# Altium schematic sheet Ethernet.SchDoc
size A3; SheetNumber: 2; SheetTotal: 14
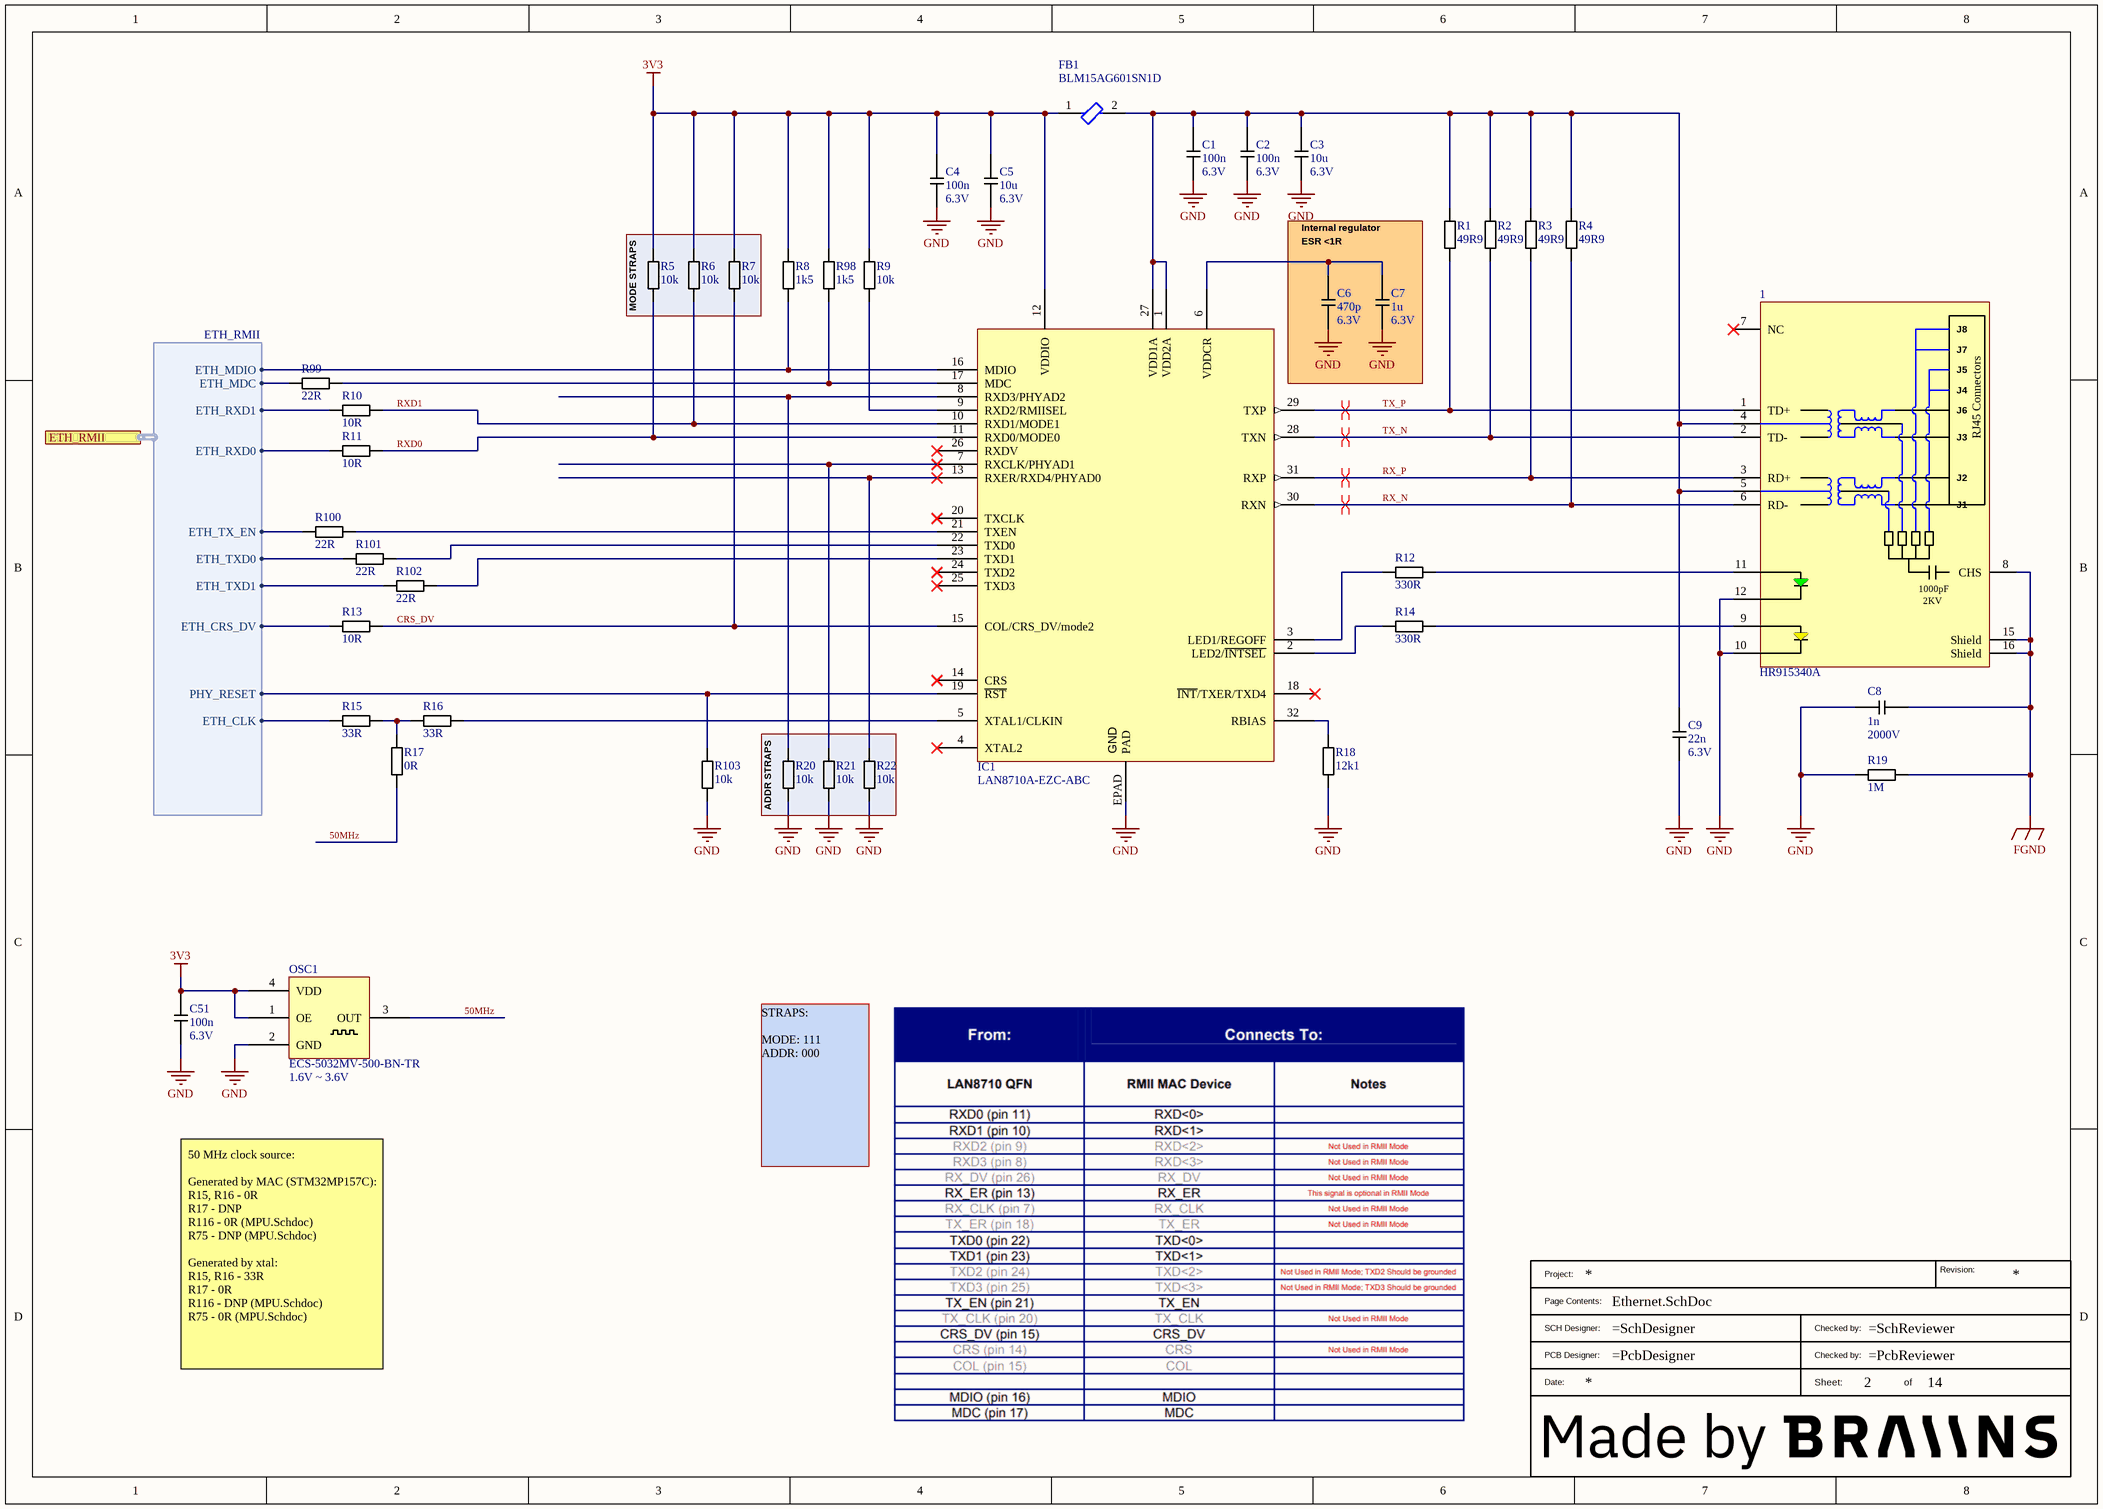
[diagram p0: Ethernet.SchDoc]

## Parts
1  HR915340A  [HR915340A]
?  BraiinsTitleBlockWithLogo  (value not drawn)  (graphical)
C1  Voltage_Rating: 6.3V  [CAP0402]  (hidden comment: 100n)
C2  Voltage_Rating: 6.3V  [CAP0402]  (hidden comment: 100n)
C3  Voltage_Rating: 6.3V  [CAP0805]  (hidden comment: 10u)
C4  Voltage_Rating: 6.3V  [CAP0402]  (hidden comment: 100n)
C5  Voltage_Rating: 6.3V  [CAP0805]  (hidden comment: 10u)
C6  Voltage_Rating: 6.3V  [CAP0402]  (hidden comment: 470p)
C7  Voltage_Rating: 6.3V  [CAP0402]  (hidden comment: 1u)
C8  Voltage_Rating: 2000V  [CAP1206]  (hidden comment: 1n)
C9  Voltage_Rating: 6.3V  [CAP0402]  (hidden comment: 22n)
C51  Voltage_Rating: 6.3V  [CAP0402]  (hidden comment: 100n)
FB1  BLM15AG601SN1D  [FP-BLM15-0_05-MFG]
IC1  LAN8710A-EZC-ABC  [QFN32]
OSC1  Voltage_Rating: 1.6V ~ 3.6V  [5032_CLOCK_GEN]  (hidden comment: ECS-5032MV-500-BN-TR)
R1  49R9  [RES0402]
R2  49R9  [RES0402]
R3  49R9  [RES0402]
R4  49R9  [RES0402]
R5  10k  [RES0402]
R6  10k  [RES0402]
R7  10k  [RES0402]
R8  1k5  [RES0402]
R9  10k  [RES0402]
R10  10R  [RES0402]
R11  10R  [RES0402]
R12  330R  [RES0402]
R13  10R  [RES0402]
R14  330R  [RES0402]
R15  33R  [RES0402]
R16  33R  [RES0402]
R17  0R  [RES0402]
R18  12k1  [RES0402]
R19  1M  [RES0603]
R20  10k  [RES0402]
R21  10k  [RES0402]
R22  10k  [RES0402]
R98  1k5  [RES0402]
R99  22R  [RES0402]
R100  22R  [RES0402]
R101  22R  [RES0402]
R102  22R  [RES0402]
R103  10k  [RES0402]

## Blocks framed on the sheet
MODE STRAPS: R5-R7
ADDR STRAPS: R20-R22

## Ports
ETH_RMII (harness ETH_RMII)

## Harnesses
ETH_RMII: ETH_CRS_DV, ETH_MDC, ETH_MDIO, ETH_CLK, ETH_RXD0, ETH_RXD1, ETH_TXD0, ETH_TXD1, ETH_TX_EN, PHY_RESET

## Nets
3V3: C4.1 C5.1 C51.1 FB1.1 IC1.12(VDDIO) OSC1.1(OE) OSC1.4(VDD) R5.1 R6.1 R7.1 R8.1 R9.1 R98.1
FGND: 1.8(CHS) 1.15(Shield) 1.16(Shield) C8.2 R19.2
GND: 1.10(C) 1.12(C) C1.2 C2.2 C3.2 C4.2 C5.2 C6.2 C7.2 C8.1 C9.2 C51.2 IC1.EPAD(PAD) OSC1.2(GND) R18.2 R19.1 R20.2 R21.2 R22.2 R103.2
50MHz: OSC1.3(OUT) R17.2
CRS_DV: IC1.15(COL/CRS_DV/mode2) R7.2 R13.2
RX_N: 1.6(RD-) IC1.30(RXN) R4.2
RX_P: 1.3(RD+) IC1.31(RXP) R3.2
RXD0: IC1.11(RXD0/MODE0) R5.2 R11.2
RXD1: IC1.10(RXD1/MODE1) R6.2 R10.2
TX_N: 1.2(TD-) IC1.28(TXN) R2.2
TX_P: 1.1(TD+) IC1.29(TXP) R1.2
Net1_4: 1.4 1.5 C1.1 C2.1 C3.1 C9.1 FB1.2 IC1.1(VDD2A) IC1.27(VDD1A) R1.1 R2.1 R3.1 R4.1
Net1_9: 1.9(A) R14.2
Net1_11: 1.11(A) R12.2
NetC6_1: C6.1 C7.1 IC1.6(VDDCR)
NetIC1_2: IC1.2(LED2/~{INTSEL}) R14.1
NetIC1_3: IC1.3(LED1/REGOFF) R12.1
NetIC1_5: IC1.5(XTAL1/CLKIN) R16.2
NetIC1_7: IC1.7(RXCLK/PHYAD1) R21.1
NetIC1_8: IC1.8(RXD3/PHYAD2) R20.1
NetIC1_9: IC1.9(RXD2/RMIISEL) R9.2
NetIC1_13: IC1.13(RXER/RXD4/PHYAD0) R22.1
NetIC1_16: IC1.16(MDIO) R8.2 ; port ETH_RMII.ETH_MDIO
NetIC1_17: IC1.17(MDC) R98.2 R99.2
NetIC1_19: IC1.19(~{RST}) R103.1 ; port ETH_RMII.PHY_RESET
NetIC1_21: IC1.21(TXEN) R100.2
NetIC1_22: IC1.22(TXD0) R101.2
NetIC1_23: IC1.23(TXD1) R102.2
NetIC1_32: IC1.32(RBIAS) R18.1
NetR10_1: R10.1 ; port ETH_RMII.ETH_RXD1
NetR11_1: R11.1 ; port ETH_RMII.ETH_RXD0
NetR13_1: R13.1 ; port ETH_RMII.ETH_CRS_DV
NetR15_1: R15.1 ; port ETH_RMII.ETH_CLK
NetR15_2: R15.2 R16.1 R17.1
NetR99_1: R99.1 ; port ETH_RMII.ETH_MDC
NetR100_1: R100.1 ; port ETH_RMII.ETH_TX_EN
NetR101_1: R101.1 ; port ETH_RMII.ETH_TXD0
NetR102_1: R102.1 ; port ETH_RMII.ETH_TXD1

Not connected (* = marked no-connect by the designer): 1 7(NC)*; IC1 4(XTAL2)* 14(CRS)* 18(~{INT}/TXER/TXD4)* 20(TXCLK)* 24(TXD2)* 25(TXD3)* 26(RXDV)*

## Layout directives
differential pair: RX_N, RX_P, TX_N, TX_P

## Notes on the sheet
- ESR <1R
- Internal regulator
- STRAPS:
  MODE: 111
  ADDR: 000
- 50 MHz clock source:
  Generated by MAC (STM32MP157C):
  R15, R16 - 0R
  R17 - DNP
  R116 - 0R (MPU.Schdoc)
  R75 - DNP (MPU.Schdoc)
  Generated by xtal:
  R15, R16 - 33R
  R17 - 0R
  R116 - DNP (MPU.Schdoc)
  R75 - 0R (MPU.Schdoc)
- (in symbol 30126) GND
- (in symbol 30130) J8; J7; J5; J4; RJ45 Connectors; J6; J3; J2; J1; 1000pF; 2KV
- (in symbol BraiinsTitleBlockWithLogo) Revision:; Project:; Page Contents:; SCH Designer:; Checked by:; PCB Designer:; Date:; Sheet:; of

## Library data of the parts
1 = 30130: 10BASE-T/100BASE-T Connector with internal magnetics; Manufacturer: HANRUN; Part_Status: New; ID: 30130; Updated By: janjuranek; Value: HR915340A; Part_Type: Connector; Manufacturer Part Number: HR915340A; Manufacturer Part Description: 10BASE-T/100BASE-T Connector with internal magnetics; Created By: janjuranek; Created_Date: 2023-03-29 08:06:37; Updated_Date: 2023-04-11 15:55:39; ComponentLink1Description: Datasheet; ComponentLink2Description: Supplier Part Details
C1 C2 C4 C51 = 30154: CAP CER 100n 10% 6.3V 0402; Part_Type: Capacitor; Part_Status: New; ID: 30154; Dielectric: X7R; Updated By: janjuranek; Sorted_Value: 100; Value: 100n; Sub_Type: CER; Manufacturer Part Description: CAP CER 100n 10% 6.3V 0402; Package_Case: 0402; RoHS: Yes; Tolerance: 10%; Created By: janjuranek; Created_Date: 2023-05-01 19:17:49; Updated_Date: 2023-05-01 19:19:14; ComponentLink1Description: Datasheet; ComponentLink2Description: Supplier Part Details
C3 C5 = 30174: CAP CER 10u 10% 6.3V X7R 0805; Part_Type: Capacitor; Part_Status: New; ID: 30174; Updated By: janjuranek; Sorted_Value: 10; Value: 10u; Sub_Type: CER; Manufacturer Part Description: CAP CER 10u 10% 6.3V X7R 0805; Package_Case: 0805; RoHS: Yes; Dielectric: X7R; Tolerance: 10%; Created By: janjuranek; Created_Date: 2023-05-09 02:18:46; Updated_Date: 2023-05-09 02:19:22; ComponentLink1Description: Datasheet; ComponentLink2Description: Supplier Part Details
C6 = 30163: CAP CER 470p 10% 6.3V X7R 0402; Part_Type: Capacitor; Part_Status: New; ID: 30163; Updated By: janjuranek; Sorted_Value: 470; Value: 470p; Sub_Type: CER; Manufacturer Part Description: CAP CER 470p 10% 6.3V X7R 0402; Package_Case: 0402; RoHS: Yes; Dielectric: X7R; Tolerance: 10%; Created By: janjuranek; Created_Date: 2023-05-01 19:44:11; Updated_Date: 2023-05-01 19:44:28; ComponentLink1Description: Datasheet; ComponentLink2Description: Supplier Part Details
C7 = 30155: CAP CER 1u 10% 6.3V X7R 0402; Part_Type: Capacitor; Part_Status: New; ID: 30155; Updated By: janjuranek; Sorted_Value: 1; Value: 1u; Sub_Type: CER; Manufacturer Part Description: CAP CER 1u 10% 6.3V X7R 0402; Package_Case: 0402; RoHS: Yes; Tolerance: 10%; Created By: janjuranek; Created_Date: 2023-05-01 19:24:23; Updated_Date: 2023-05-01 19:25:09; ComponentLink1Description: Datasheet; ComponentLink2Description: Supplier Part Details; Dielectric: X7R
C8 = 30107: CAP CER 1n 5% 2000V 1206; Part_Type: Capacitor; Part_Status: New; ID: 30107; Updated By: janjuranek; Sorted_Value: 1; Value: 1n; Sub_Type: CER; Manufacturer Part Description: CAP CER 1n 5% 2000V 1206; Package_Case: 1206; RoHS: Yes; Tolerance: 5%; Created By: janjuranek; Created_Date: 2023-03-14 13:31:22; Updated_Date: 2023-03-14 13:32:03; ComponentLink1Description: Datasheet; ComponentLink2Description: Supplier Part Details
C9 = 30161: CAP CER 22n 10% 6.3V X7R 0402; Part_Type: Capacitor; Part_Status: New; ID: 30161; Updated By: janjuranek; Sorted_Value: 22; Value: 22n; Sub_Type: CER; Manufacturer Part Description: CAP CER 22n 10% 6.3V X7R 0402; Package_Case: 0402; RoHS: Yes; Tolerance: 10%; Created By: janjuranek; Created_Date: 2023-05-01 19:41:33; Updated_Date: 2023-05-01 19:42:04; ComponentLink1Description: Datasheet; ComponentLink2Description: Supplier Part Details; Dielectric: X7R
FB1 = CMP-0686-00187-4: Chip Ferrite Bead, 0402, 600Ω @ 100MHz, 0.52Ω, 25%, 300mA; DC Resistance-Max: 600mR; Number of Lines: 1; DC Resistance (DCR): 520mR; Shielding: Unshielded; Impedance: 600R; Material: Steel; Frequency: 100MHz; Lead Free: Lead Free; Max DC Current: 300mA; Test Frequency: 100MHz; Depth: 0.55mm; Length: 1mm; Case Code (Imperial): 0402; Packaging: Tape and Reel; Height: 0.5mm; Max Operating Temperature: 125°C; Military Standard: Not; REACH SVHC: No SVHC; Case Code (Metric): 1005; Series: BLM15AG_SN; Core Material: Ferrite; Termination: SMD/SMT; DC Current: 300mA; Package Quantity: 10000; Width: 0.5mm; RoHS Compliant: Yes; Min Operating Temperature: -55°C; Current Rating: 300mA; Case/Package: 0402; Number of Pins: 2; Radiation Hardening: No; Tolerance: 25%; Number of Circuits: 1; Max Current Rating: 300mA
IC1 = 30126: 10BASE-T/100BASE-TX PHY; Part_Type: IC; Manufacturer: Microchip; Part_Status: New; ID: 30126; Updated By: janjuranek; Notes: Missing 3D model.; Value: LAN8710A-EZC-ABC; Manufacturer Part Number: LAN8710A-EZC-ABC; Manufacturer Part Description: 10BASE-T/100BASE-TX PHY; RoHS: Yes; Created By: janjuranek; Created_Date: 2023-03-28 20:05:49; Updated_Date: 2023-04-06 10:16:27; ComponentLink1Description: Datasheet; ComponentLink2Description: Supplier Part Details
OSC1 = 30144: XTAL OSC 50MHZ HCMOS SMD; Manufacturer: ECS Inc.; Part_Status: New; ID: 30144; Current_Rating: 8mA; Updated By: janjuranek; Value: ECS-5032MV-500-BN-TR; Part_Type: XTAL; Manufacturer Part Number: ECS-5032MV-500-BN-TR; Manufacturer Part Description: XTAL OSC 50MHZ HCMOS SMD; Supplier 1: Digi-Key; Supplier Part Number 1: 50-ECS-5032MV-500-BN-TR-ND; RoHS: Yes; Temperature Range: -40C to +85C; Created By: janjuranek; Created_Date: 2023-04-16 22:19:10; Updated_Date: 2023-04-16 22:19:46; ComponentLink1Description: Datasheet; ComponentLink2Description: Supplier Part Details; ComponentLink2URL: https://www.digikey.com/products/en?keywords=ECS-5032MV-500-BN-TR
R1-R4 = 30160: RES 49R9 Ohm 1% 0402; Part_Status: New; ID: 30160; Updated By: janjuranek; Sorted_Value: 49; Value: 49R9; Part_Type: Resistor; Manufacturer Part Description: RES 49R9 Ohm 1% 0402; Package_Case: 0402; RoHS: Yes; Tolerance: 1%; Created By: janjuranek; Created_Date: 2023-05-01 19:40:18; Updated_Date: 2023-05-01 19:40:31; ComponentLink1Description: Datasheet; ComponentLink2Description: Supplier Part Details
R5-R7 R20-R22 R103 = 30071: RES 10k Ohm 1% 0402; Part_Status: New; ID: 30071; Updated By: Jan; Sorted_Value: 10000; Value: 10k; Part_Type: Resistor; Manufacturer Part Description: RES 10k Ohm 1% 0402; Package_Case: 0402; RoHS: Yes; Tolerance: 1%; Created By: Jan; Created_Date: 2023-03-02 13:13:56; Updated_Date: 2023-03-02 13:14:31; ComponentLink1Description: Datasheet; ComponentLink2Description: Supplier Part Details; Temperature Range: -40 to +150C
R8 R98 = 30158: RES 1k5 Ohm 1% 0402; Part_Status: New; ID: 30158; Updated By: janjuranek; Sorted_Value: 1; Value: 1k5; Part_Type: Resistor; Manufacturer Part Description: RES 1k5 Ohm 1% 0402; Package_Case: 0402; RoHS: Yes; Tolerance: 1%; Created By: janjuranek; Created_Date: 2023-05-01 19:36:30; Updated_Date: 2023-05-01 19:36:42; ComponentLink1Description: Datasheet; ComponentLink2Description: Supplier Part Details
R9 = 30071: RES 10k Ohm 1% 0402; Part_Status: New; ID: 30071; Updated By: janjuranek; Sorted_Value: 10000; Value: 10k; Part_Type: Resistor; Manufacturer Part Description: RES 10k Ohm 1% 0402; Package_Case: 0402; RoHS: Yes; Tolerance: 1%; Created By: Jan; Created_Date: 2023-03-02 13:13:56; Updated_Date: 2023-05-01 19:36:28; ComponentLink1Description: Datasheet; ComponentLink2Description: Supplier Part Details; Temperature Range: -40 to +150C
R10 R11 R13 = 30162: RES 10R Ohm 1% 0402; Part_Status: New; ID: 30162; Updated By: janjuranek; Sorted_Value: 10; Value: 10R; Part_Type: Resistor; Manufacturer Part Description: RES 10R Ohm 1% 0402; Package_Case: 0402; RoHS: Yes; Tolerance: 1%; Created By: janjuranek; Created_Date: 2023-05-01 19:42:43; Updated_Date: 2023-05-01 19:42:58; ComponentLink1Description: Datasheet; ComponentLink2Description: Supplier Part Details
R12 R14 = 30083: RES 330R Ohm 1% 0402; Part_Status: New; ID: 30083; Updated By: Jan; Sorted_Value: 330; Value: 330R; Part_Type: Resistor; Manufacturer Part Description: RES 330R Ohm 1% 0402; Package_Case: 0402; RoHS: Yes; Tolerance: 1%; Created By: Jan; Created_Date: 2023-03-02 15:51:16; Updated_Date: 2023-03-02 15:51:32; ComponentLink1Description: Datasheet; ComponentLink2Description: Supplier Part Details
R15 R16 = 30088: RES 33R Ohm 1% 0402; Part_Status: New; ID: 30088; Updated By: jju; Sorted_Value: 33; Value: 33R; Part_Type: Resistor; Manufacturer Part Description: RES 33R Ohm 1% 0402; Package_Case: 0402; RoHS: Yes; Tolerance: 1%; Created By: jju; Created_Date: 2023-03-06 16:34:08; Updated_Date: 2023-03-06 16:34:37; ComponentLink1Description: Datasheet; ComponentLink2Description: Supplier Part Details
R17 = 30178: RES 0R Ohm 1% 0402; Part_Status: New; ID: 30178; Updated By: janjuranek; Sorted_Value: 0; Value: 0R; Part_Type: Resistor; Manufacturer Part Description: RES 0R Ohm 1% 0402; Package_Case: 0402; RoHS: Yes; Tolerance: 1%; Created By: janjuranek; Created_Date: 2023-05-15 08:47:05; Updated_Date: 2023-05-15 08:47:18; ComponentLink1Description: Datasheet; ComponentLink2Description: Supplier Part Details
R18 = 30159: RES 12k1 Ohm 1% 0402; Part_Status: New; ID: 30159; Updated By: janjuranek; Sorted_Value: 12; Value: 12k1; Part_Type: Resistor; Manufacturer Part Description: RES 12k1 Ohm 1% 0402; Package_Case: 0402; RoHS: Yes; Tolerance: 1%; Created By: janjuranek; Created_Date: 2023-05-01 19:38:53; Updated_Date: 2023-05-01 19:39:06; ComponentLink1Description: Datasheet; ComponentLink2Description: Supplier Part Details
R19 = 30054: RES 1M Ohm 0,01 0603 (1608 Metric); Manufacturer Part Number: Generic resistor 1M; Part_Status: New; ID: 30054; Tolerance: 0,01; Updated By: Jan; Sorted_Value: 1000000; Value: 1M; Part_Type: Resistor; Manufacturer Part Description: RES 1M Ohm 0,01 0603 (1608 Metric); Package_Case: 0603; Created By: Jan; Created_Date: 2023-03-01 20:43:33; Updated_Date: 2023-03-01 21:23:54; ComponentLink1Description: Datasheet; ComponentLink2Description: Supplier Part Details
R99-R102 = 30156: RES 22R Ohm 1% 0402; Part_Status: New; ID: 30156; Updated By: janjuranek; Sorted_Value: 22; Value: 22R; Part_Type: Resistor; Manufacturer Part Description: RES 22R Ohm 1% 0402; Package_Case: 0402; RoHS: Yes; Tolerance: 1%; Created By: janjuranek; Created_Date: 2023-05-01 19:29:39; Updated_Date: 2023-05-01 19:30:05; ComponentLink1Description: Datasheet; ComponentLink2Description: Supplier Part Details